# Altium schematic sheet RS-232.SchDoc
size A
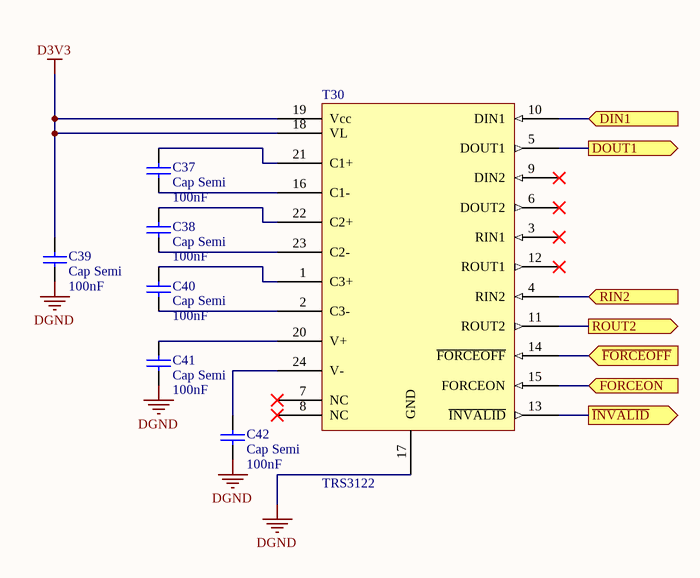
[diagram p0: RS-232.SchDoc]

## Parts
C37  Cap Semi  value 100nF  [1608[0603]]
C38  Cap Semi  value 100nF  [1608[0603]]
C39  Cap Semi  value 100nF  [1608[0603]]
C40  Cap Semi  value 100nF  [1608[0603]]
C41  Cap Semi  value 100nF  [1608[0603]]
C42  Cap Semi  value 100nF  [1608[0603]]
T30  TRS3122  [QFN50P485X485X100_HS-25N]

## Ports
DIN1 (in), DOUT1 (out), FORCEON (in), RIN2 (in), ROUT2 (out), ~{FORCEOFF} (in), ~{INVALID} (out)

## Nets
D3V3: C39.1 T30.18(VL) T30.19(Vcc)
DGND: C39.2 C41.2 C42.2 T30.17(GND)
DIN1: T30.10(DIN1) ; port DIN1
DOUT1: T30.5(DOUT1) ; port DOUT1
~{FORCEOFF}: T30.14(~{FORCEOFF}) ; port ~{FORCEOFF}
FORCEON: T30.15(FORCEON) ; port FORCEON
~{INVALID}: T30.13(~{INVALID}) ; port ~{INVALID}
RIN2: T30.4(RIN2) ; port RIN2
ROUT2: T30.11(ROUT2) ; port ROUT2
NetC37_1: C37.1 T30.21(C1+)
NetC37_2: C37.2 T30.16(C1-)
NetC38_1: C38.1 T30.22(C2+)
NetC38_2: C38.2 T30.23(C2-)
NetC40_1: C40.1 T30.1(C3+)
NetC40_2: C40.2 T30.2(C3-)
NetC41_1: C41.1 T30.20(V+)
NetC42_1: C42.1 T30.24(V-)

Not connected (* = marked no-connect by the designer): T30 3(RIN1)* 6(DOUT2)* 7(NC)* 8(NC)* 9(DIN2)* 12(ROUT1)*

## Library data of the parts
C37-C42 = Cap Semi: Capacitor (Semiconductor SIM Model); Published: 8-Jun-2000; LatestRevisionDate: 29-May-2009; LatestRevisionNote: IPC-7351 Footprint Added.; PackageReference: C1206; Publisher: Altium Limited; PackageDescription: Chip Capacitor
T30 = Component_1